# Altium schematic sheet ControllerV0.SchDoc (part 3 of 3)
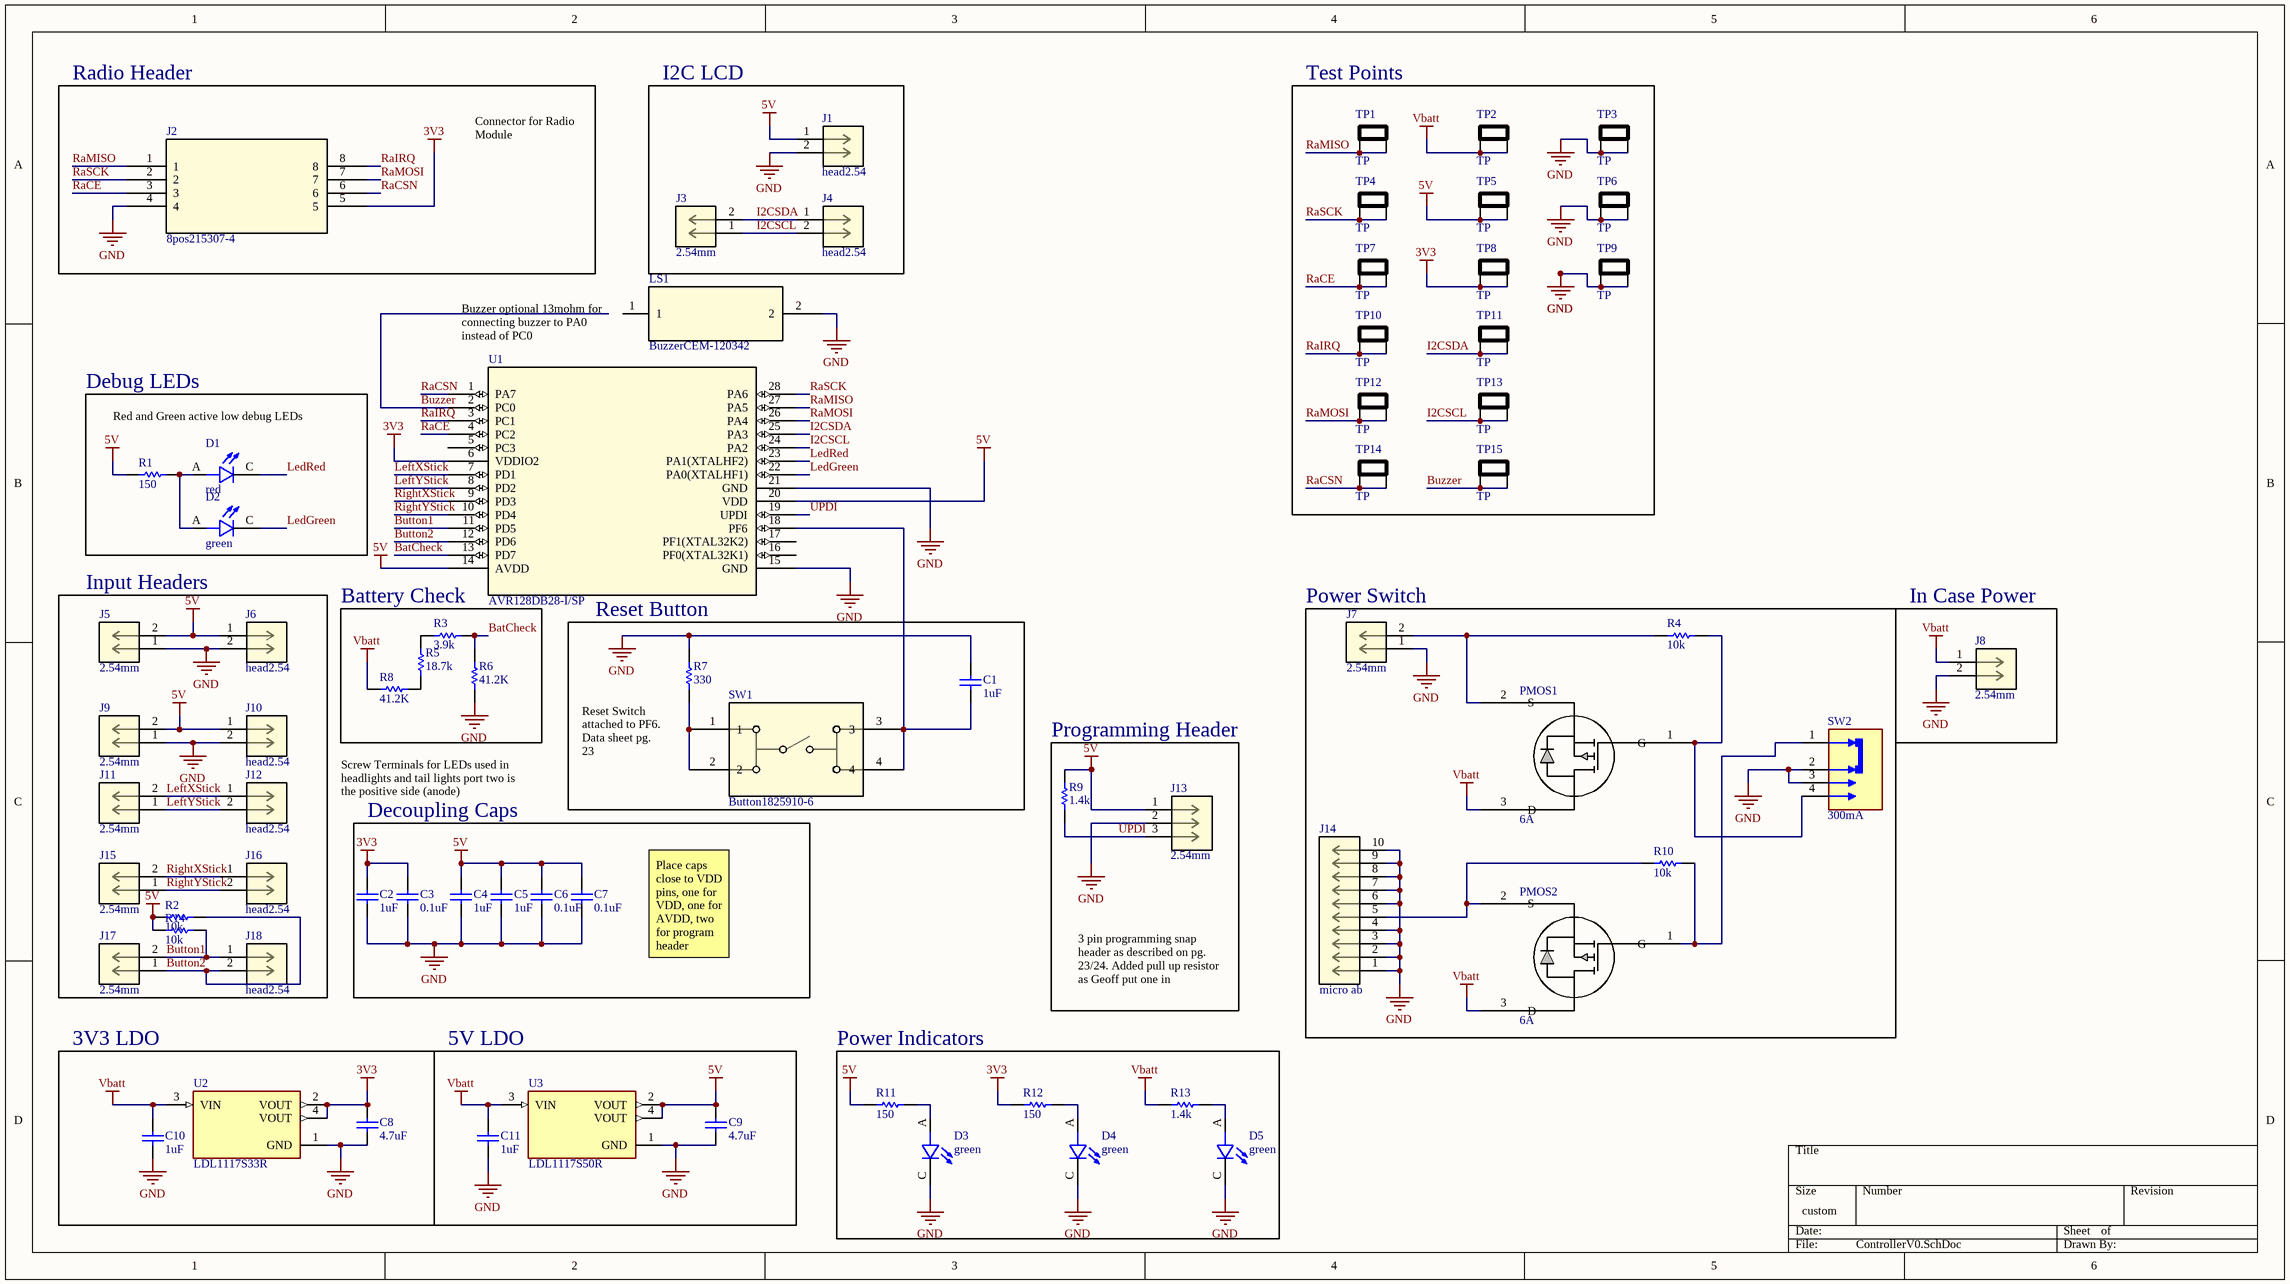
[diagram p2: ControllerV0.SchDoc]

## Library data of the parts (continued)
U3 = LDL1117S50R: Fixed Positive LDO Regulator, 5V, 0.6V Dropout, PDSO4; Manufacturer: STMicroelectronics; Package Body Material: Plastic; Dropout Voltage1-Max: 600mV; Max Supply Voltage: 18V; Min Input Voltage: 6V; Channels: 1; Output Current1-Max: 1.2A; Output Voltage1-Max: 5.15V; Output Voltage1-Min: 4.85V; Regulator Type: FIXED POSITIVE SINGLE OUTPUT LDO REGULATOR; Supplier: Arrow Electronics; Supplier Part Number: LDL1117S50R; Manufacturer Part Number: LDL1117S50R; RoHS: Yes; Category: Voltage Regulators - Linear; Stock: 195470; Pricing: 1=0.4496, 10=0.2819, 25=0.2795, 50=0.2738, 100=0.2253, 250=0.2208, 500=0.2045, 1000=0.1573 (USD); Case/Package: SOP; Pins: 4; Package Shape: Rectangular; JESD-30 Code: R-PDSO-G4; Operating Temperature, TJ-Max: 125°C; Operating Temperature, TJ-Min: -40°C; Output Voltage1-Nom: 5V; Package Style: SMALL OUTLINEMeter; Surface Mount: Yes; Terminal Form: Gull Wing; Terminal Position: DUAL; Length: 6.5mm; Width: 3.5mm; Height - Seated (Max): 1.9mm; Terminal Pitch: 2.3mm; Reach SVHC Compliant: Yes; RoHS Compliant: Yes; ComponentLink1URL: https://datasheet.ciiva.com:443/pdfs/VipMasterIC/IC/SGST/SGST-S-A0010030722/SGST-S-A0010030722-1.pdf?src-supplier=IHS+Markit; ComponentLink1Description: https://datasheet.ciiva.com:443/pdfs/VipMasterIC/IC/SGST/SGST-S-A0010030722/SGST-S-A0010030722-1.pdf?src-supplier=IHS+Markit; ComponentLink2URL: http://www.farnell.com/datasheets/2259188.pdf?src-supplier=Farnell; ComponentLink2Description: http://www.farnell.com/datasheets/2259188.pdf?src-supplier=Farnell; ComponentLink3URL: http://www.st.com/content/ccc/resource/technical/document/datasheet/group3/0e/5a/00/ca/10/1a/4f/a5/DM00366442/files/DM00366442.pdf/jcr:content/translations/en.DM00366442.pdf?src-supplier=Digikey; ComponentLink3Description: http://www.st.com/content/ccc/resource/technical/document/datasheet/group3/0e/5a/00/ca/10/1a/4f/a5/DM00366442/files/DM00366442.pdf/jcr:content/translations/en.DM00366442.pdf?src-supplier=Digikey; ComponentLink4URL: http://www.farnell.com/datasheets/2259188.pdf?src-supplier=Newark; ComponentLink4Description: http://www.farnell.com/datasheets/2259188.pdf?src-supplier=Newark